# Altium schematic sheet Лист 5.SchDoc
size 420 x 297 mm; Address1: Address1; Address2: Address2; Address3: Address3; Address4: Address4; SheetNumber: 1; Scale: 1:1; Разраб.: Иванов; Обозначение документа: АЛ.001.001 Э3; Пров.: Петров; Утв.: Сидоров; Номер листа: 5; Общее количество листов: 5; Масштаб: 1:1; Наименование организации: ОАО "Ваша фирма"; Перв. применение: АБВГ.123456.000; Наименование изделия 3: Схема электрическая принципиальная; Нач. отд.: Нач. отд.; Фамилия нач. отд.: Сидоров
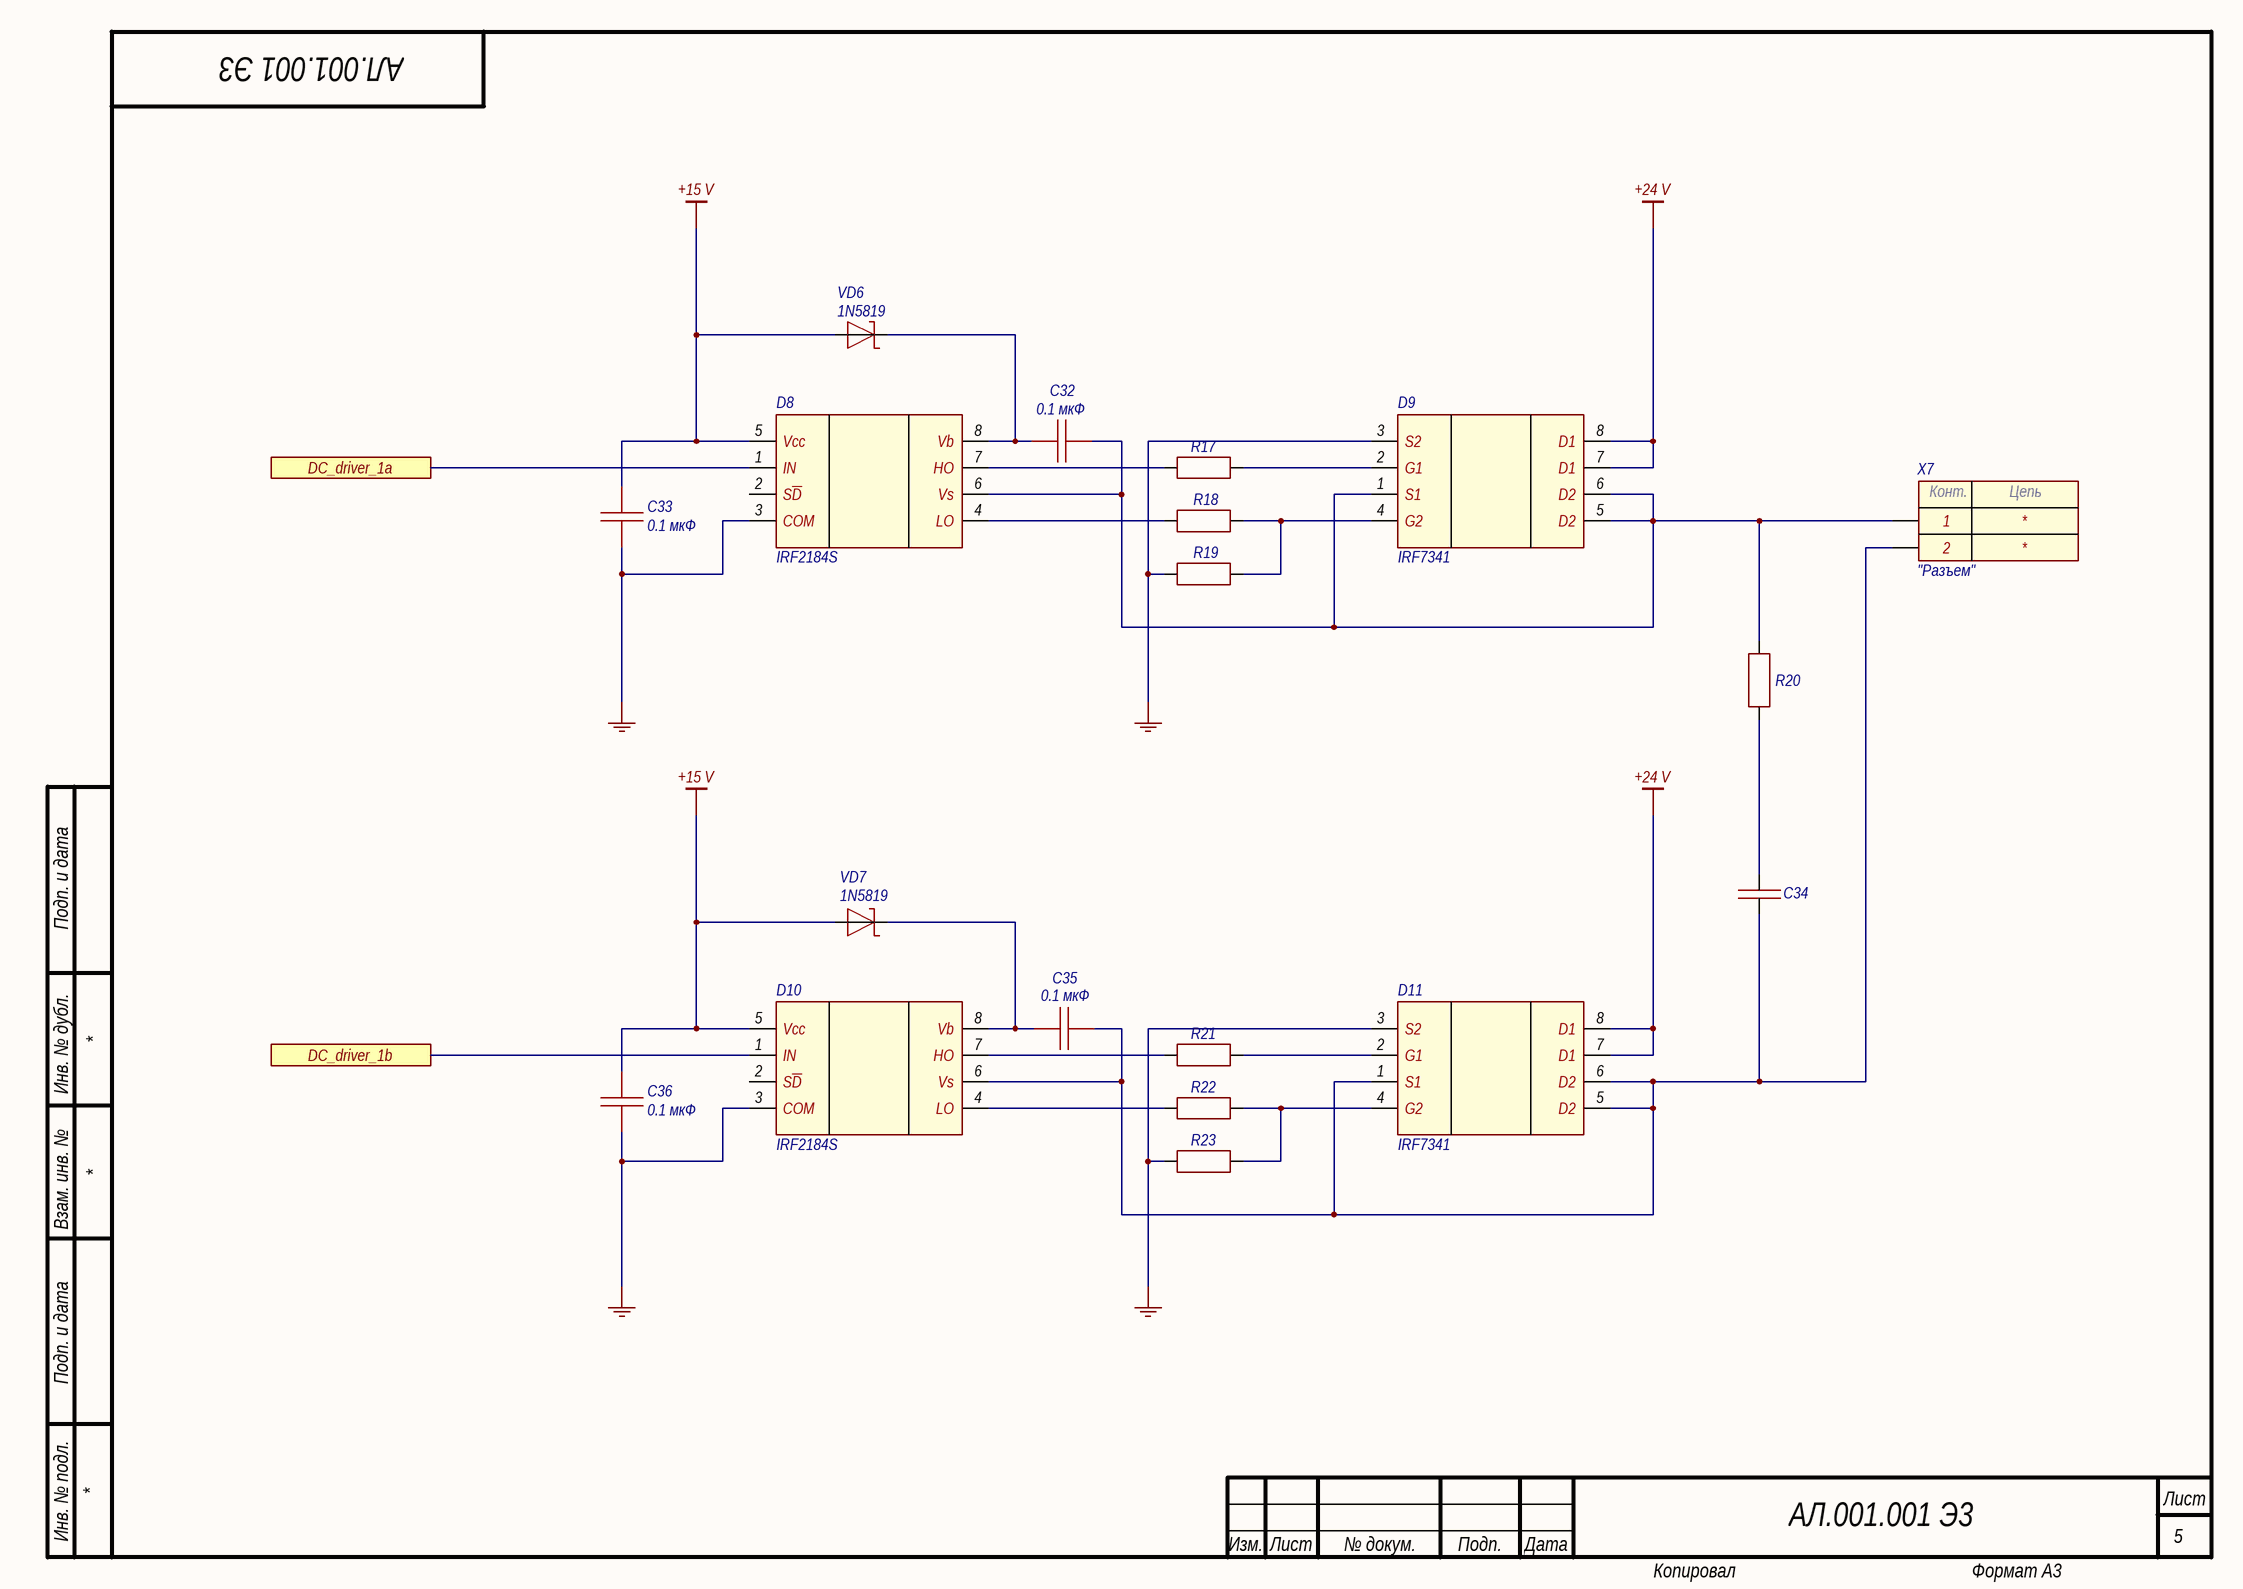
[diagram p0: Лист 5.SchDoc]

## Parts
C32  value 0.1 мкФ  [CAP: 1210]
C33  value 0.1 мкФ  [CAP: 1210]
C34  (no value)  [CAP: 0805]
C35  value 0.1 мкФ  [CAP: 1210]
C36  value 0.1 мкФ  [CAP: 1210]
D8  IRF2184S  [8-SOIC]
D9  IRF7341  [8-SOIC]
D10  IRF2184S  [8-SOIC]
D11  IRF7341  [8-SOIC]
R17  2,7 кОм  [RES: 0805]  (value not drawn)
R18  2,7 кОм  [RES: 0805]  (value not drawn)
R19  2,7 кОм  [RES: 0805]  (value not drawn)
R20  2,7 кОм  [RES: 0805]  (value not drawn)
R21  2,7 кОм  [RES: 0805]  (value not drawn)
R22  2,7 кОм  [RES: 0805]  (value not drawn)
R23  2,7 кОм  [RES: 0805]  (value not drawn)
VD6  PartNumber: 1N5819  [DIODE: SOD123]
VD7  PartNumber: 1N5819  [DIODE: SOD123]
X7  CommentText: "Разъем"  [CON: CWF-2]

## Ports
DC_driver_1a, DC_driver_1b

## Nets
+15 V: C33.2 C36.2 D8.5(Vcc) D10.5(Vcc) VD6.1 VD7.1
+24 V: D9.7(D1) D9.8(D1) D11.7(D1) D11.8(D1)
GND: C33.1 C36.1 D8.3(COM) D9.3(S2) D10.3(COM) D11.3(S2) R19.2 R23.2
DC_driver_1a: D8.1(IN) ; port DC_driver_1a
DC_driver_1b: D10.1(IN) ; port DC_driver_1b
NetC32_1: C32.1 D8.6(Vs) D9.1(S1) D9.5(D2) D9.6(D2) R20.1 X7.1
NetC32_2: C32.2 D8.8(Vb) VD6.2
NetC34_1: C34.1 C35.1 D10.6(Vs) D11.1(S1) D11.5(D2) D11.6(D2) X7.2
NetC34_2: C34.2 R20.2
NetC35_2: C35.2 D10.8(Vb) VD7.2
NetD8_4: D8.4(LO) R18.2
NetD8_7: D8.7(HO) R17.2
NetD9_2: D9.2(G1) R17.1
NetD9_4: D9.4(G2) R18.1 R19.1
NetD10_4: D10.4(LO) R22.2
NetD10_7: D10.7(HO) R21.2
NetD11_2: D11.2(G1) R21.1
NetD11_4: D11.4(G2) R22.1 R23.1

Not connected (* = marked no-connect by the designer): D8 2(S~{D}); D10 2(S~{D})

## Notes on the sheet
- Подп. и дата
- Инв. № дубл.
- Взам. инв. №
- Инв. № подл.
- Изм.
- Лист
- № докум.
- Подп.
- Дата
- Копировал
- Формат А3
- (in symbol CWF-2R(CWF-2)) Конт.; Цепь

## Library data of the parts
C32 C33 C35 C36 = Ceramic_1210: Manufacturer: Yageo; PartNumber: CC1210KKX7R9BB104; ValueManufacturerPartNumber: Ceramic capacitor, 0.1 мкФ, X7R, ±10%, 50V, 1210, -55...+125°C; TypeCapacitor: Ceramic capacitor; Tolerance: ±10%; TypeDielectric: X7R; Voltage: 50V; Package: 1210; HelpURL: https://www.digikey.com/product-detail/en/yageo/CC1210KKX7R9BB104/311-4522-1-ND/8025611; Temperature: -55...+125°C
C34 = Ceramic_0805: Manufacturer: Yageo; PartNumber: CC0805KRX7R7BB104; ValueManufacturerPartNumber: Ceramic capacitor, 0.1 мкФ, X7R, ±10%, 16 В, 0805, -55...+125°C; TypeCapacitor: Ceramic capacitor; Tolerance: ±10%; TypeDielectric: X7R; Voltage: 16 В; Value: 0.1 мкФ; Package: 0805; HelpURL: https://www.digikey.com/product-detail/en/yageo/CC0805KRX7R7BB104/311-1142-1-ND/303052; Temperature: -55...+125°C
R17-R23 = Resistor_0805: Manufacturer: Yageo; PartNumber: RC0805JR-07100RL; ValueManufacturerPartNumber: Resistor film, 4,7 кОм, ±5%, 0805, 0.125W, -55...+125°C; TypeResistor: Resistor film; Power: 0.125W; Tolerance: ±5%; Value: 4,7 кОм; Package: 0805; HelpURL: https://www.digikey.com/product-detail/en/yageo/RC0805JR-07100RL/311-100ARCT-ND/731185; Temperature: -55...+125°C
VD6 VD7 = Schottky_single: Manufacturer: Diodes Incorporated; ValueManufacturerPartNumber: Schottky diode, 80V, 500mA, 1V, 15pF, SOD-123, -55...+150°C; TypeDiode: Schottky diode; Voltage: 80V; Current: 500mA; VoltageDrop: 1V; RecoveryTime: 15pF; Package: SOD-123; HelpURL: https://www.digikey.com/product-detail/en/diodes-incorporated/MBR0580S1-7/MBR0580S1-7DICT-ND/5080371; Temperature: -55...+150°C
X7 = CWF-2R(CWF-2): Manufacturer: Connfly; ValueManufacturerPartNumber: Connector, 2pin, 2.54mm, 250VAC, 3A; PartNumber: CWF-2R; TypeConnector: Connector; VoltageMax: 250VAC; Pitch: 2.54mm; CurrentMax: 3A; Multichannel: 2pin; HelpURL: https://www.chipdip.ru/product/cwf-2r-ds1069-2-mr; Pin1: *; Pin2: *